# Altium schematic sheet Sheet6.SchDoc
size B; SheetNumber: 2
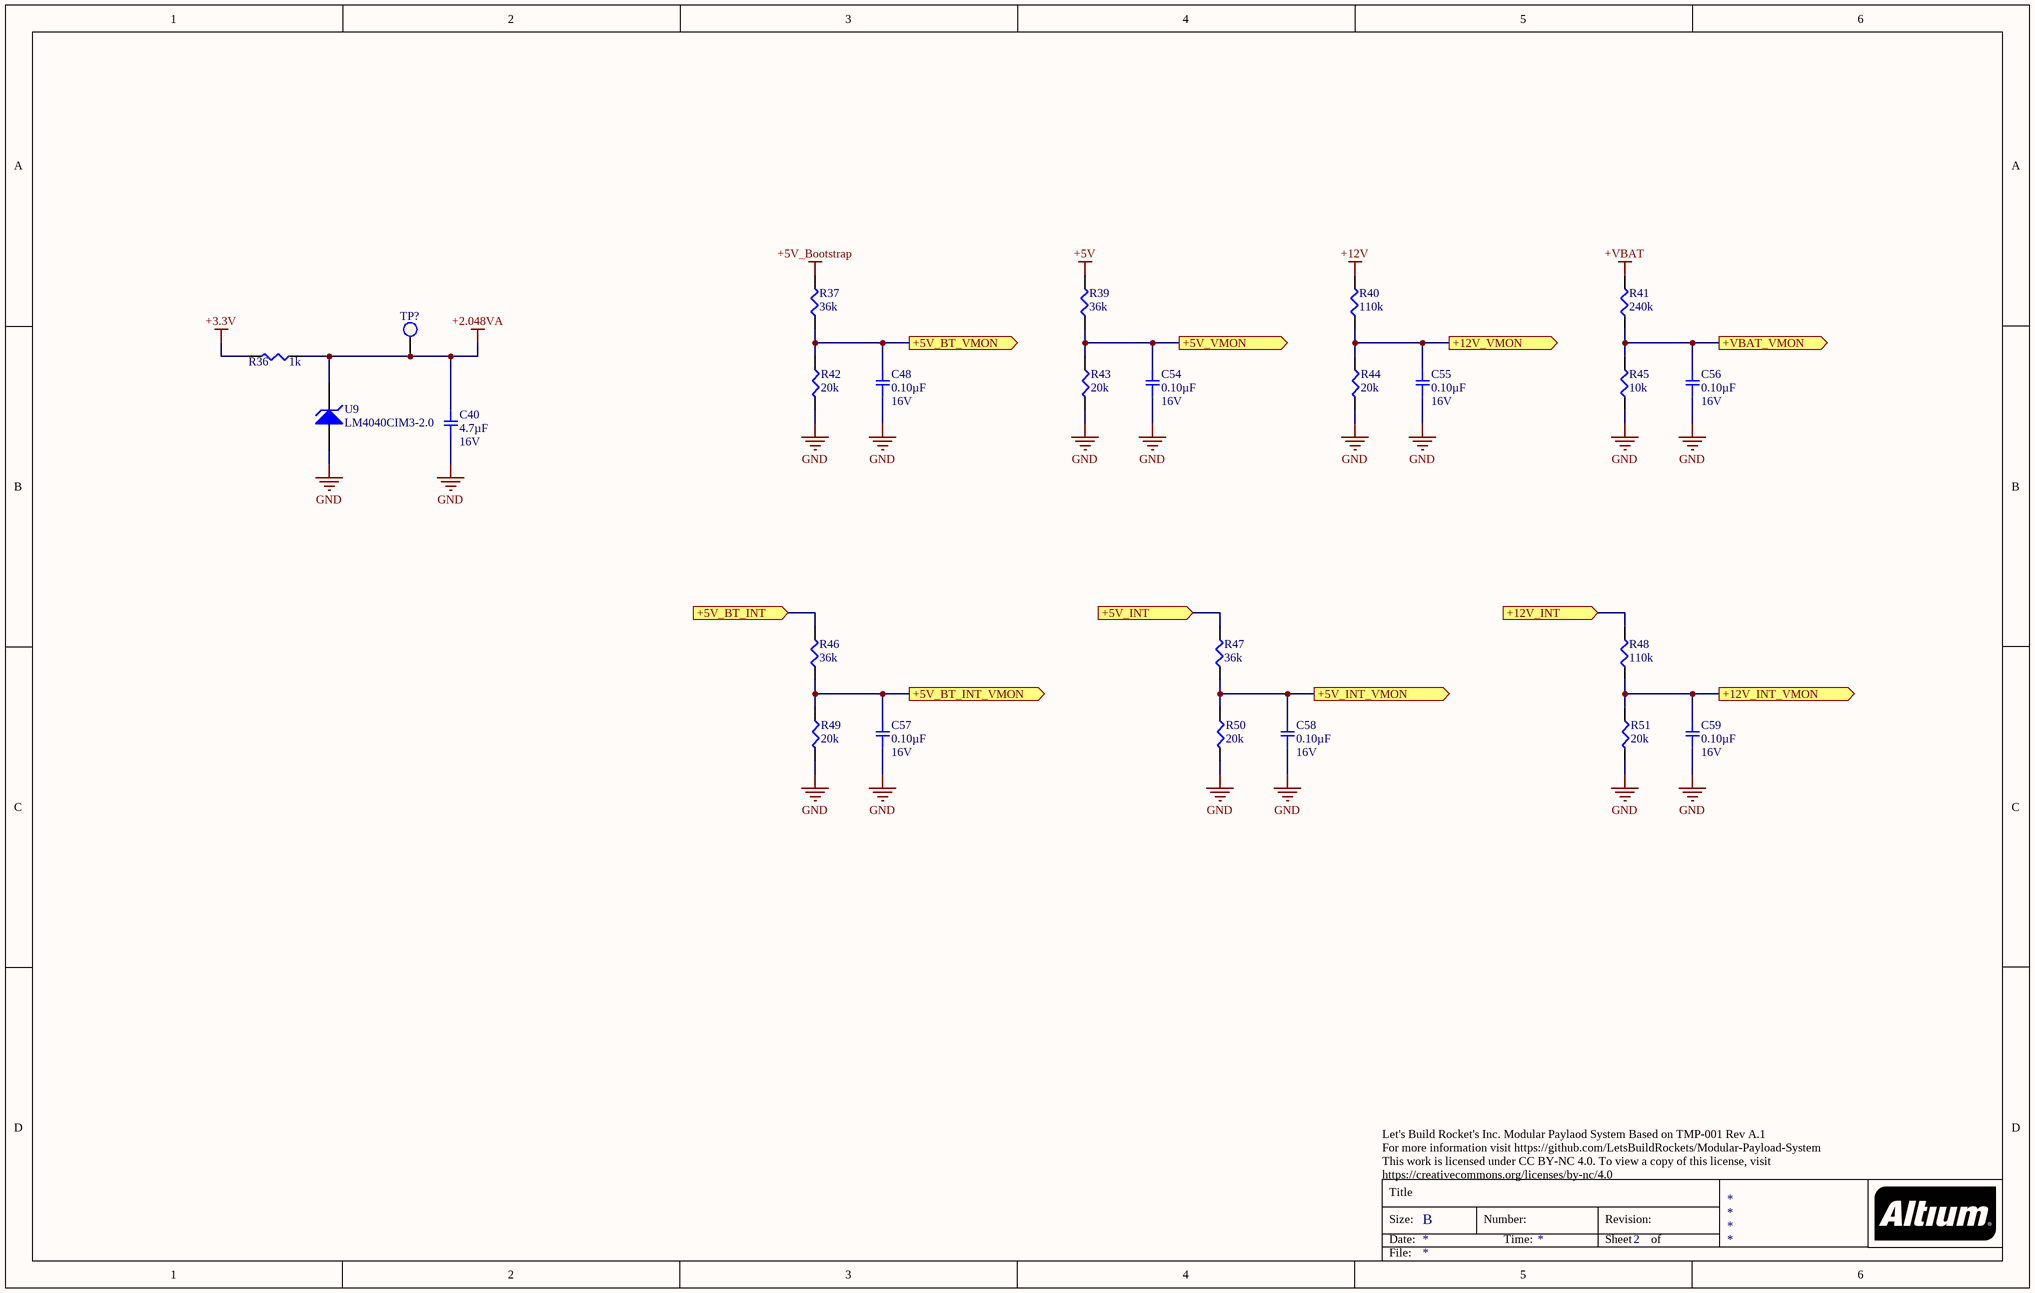
[diagram p0: Sheet6.SchDoc]

## Parts
C40  4.7µF  Voltage: 16V  [SMD-0805C]
C48  0.10µF  Voltage: 16V  [SMD-0402C]
C54  0.10µF  Voltage: 16V  [SMD-0402C]
C55  0.10µF  Voltage: 16V  [SMD-0402C]
C56  0.10µF  Voltage: 16V  [SMD-0402C]
C57  0.10µF  Voltage: 16V  [SMD-0402C]
C58  0.10µF  Voltage: 16V  [SMD-0402C]
C59  0.10µF  Voltage: 16V  [SMD-0402C]
R36  1k  [SMD-0402-RES]
R37  36k  [SMD-0805-RES]
R39  36k  [SMD-0805-RES]
R40  110k  [SMD-0805-RES]
R41  240k  [SMD-0805-RES]
R42  20k  [SMD-0805-RES]
R43  20k  [SMD-0805-RES]
R44  20k  [SMD-0805-RES]
R45  10k  [SMD-0805-RES]
R46  36k  [SMD-0805-RES]
R47  36k  [SMD-0805-RES]
R48  110k  [SMD-0805-RES]
R49  20k  [SMD-0805-RES]
R50  20k  [SMD-0805-RES]
R51  20k  [SMD-0805-RES]
TP?  TP  [TP_SMD_40]  (value not drawn)  (no BOM)
U9  LM4040CIM3-2.0  [SOT95P237X112-3N (LM4040)]

## Ports
+5V_BT_INT (in), +5V_BT_INT_VMON (out), +5V_BT_VMON (out), +5V_INT (in), +5V_INT_VMON (out), +5V_VMON (out), +12V_INT (in), +12V_INT_VMON (out), +12V_VMON (out), +VBAT_VMON (out)

## Nets
+2.048VA: C40.2 R36.1 TP?.1 U9.K
+3.3V: R36.2
+5V: R39.2
+5V_Bootstrap: R37.2
+12V: R40.2
+VBAT: R41.2
GND: C40.1 C48.1 C54.1 C55.1 C56.1 C57.1 C58.1 C59.1 R42.2 R43.2 R44.2 R45.1 R49.2 R50.2 R51.2 U9.A
+5V_BT_INT: R46.2 ; port +5V_BT_INT
+5V_BT_INT_VMON: C57.2 R46.1 R49.1 ; port +5V_BT_INT_VMON
+5V_BT_VMON: C48.2 R37.1 R42.1 ; port +5V_BT_VMON
+5V_INT: R47.2 ; port +5V_INT
+5V_INT_VMON: C58.2 R47.1 R50.1 ; port +5V_INT_VMON
+5V_VMON: C54.2 R39.1 R43.1 ; port +5V_VMON
+12V_INT: R48.2 ; port +12V_INT
+12V_INT_VMON: C59.2 R48.1 R51.1 ; port +12V_INT_VMON
+12V_VMON: C55.2 R40.1 R44.1 ; port +12V_VMON
+VBAT_VMON: C56.2 R41.1 R45.2 ; port +VBAT_VMON

## Notes on the sheet
- Let's Build Rocket's Inc. Modular Paylaod System Based on TMP-001 Rev A.1
  For more information visit https://github.com/LetsBuildRockets/Modular-Payload-System
  This work is licensed under CC BY-NC 4.0. To view a copy of this license, visit https://creativecommons.org/licenses/by-nc/4.0
- Title
- Size:
- Date:
- B
- Number:
- Time:
- Revision:
- Sheet
- of
- File:

## Library data of the parts
C40 = GCJ21BR71C475KA01L: CAP CER 4.7UF 16V X7R 0805; Manufacturer: Murata Electronics North America; Factory Stock: 0; Unit Price (USD): 0.44; Minimum Quantity: 1; Tolerance: ±10%; Datasheets: http://www.murata.com/~/media/webrenewal/support/library/catalog/products/capacitor/mlcc/c03e.ashx; Image: //media.digikey.com/Renders/Murata%20Renders/0805%20(2012%20Metric)%20.85mm.jpg; Digi-Key Part Number: 490-10557-1-ND; Part Number: GCJ21BR71C475KA01L; Quantity Available: 53217; @ qty: 0; Packaging: Cut Tape (CT); Series: GCJ; Part Status: Active; Value: 4.7µF; Temperature Coefficient: X7R; Operating Temperature: -55°C ~ 125°C; Features: Soft Termination; Ratings: AEC-Q200; Applications: Automotive, Boardflex Sensitive; Mounting Type: Surface Mount, MLCC; Package / Case: 0805 (2012 Metric); Size / Dimension: 0.079" L x 0.049" W (2.00mm x 1.25mm); Height - Seated (Max): -; Thickness (Max): 0.057" (1.45mm); Lead Spacing: -; Lead Style: -
C48 C54-C59 = GCM155R71C104KA55D: CAP CER 0.1UF 16V X7R 0402; Manufacturer: Murata Electronics North America; Factory Stock: 0; Unit Price (USD): 0.1; Minimum Quantity: 1; Tolerance: ±10%; Datasheets: http://www.murata.com/~/media/webrenewal/support/library/catalog/products/capacitor/mlcc/c03e.ashx; Image: //media.digikey.com/Renders/Murata%20Renders/ZRB-SERIES-0402.jpg; Digi-Key Part Number: 490-4759-1-ND; Part Number: GCM155R71C104KA55D; Quantity Available: 734194; @ qty: 0; Packaging: Cut Tape (CT); Series: GCM; Part Status: Active; Value: 0.10µF; Temperature Coefficient: X7R; Operating Temperature: -55°C ~ 125°C; Features: -; Ratings: AEC-Q200; Applications: Automotive; Mounting Type: Surface Mount, MLCC; Package / Case: 0402 (1005 Metric); Size / Dimension: 0.039" L x 0.020" W (1.00mm x 0.50mm); Height - Seated (Max): -; Thickness (Max): 0.022" (0.55mm); Lead Spacing: -; Lead Style: -
R36 = ERJ-2GEJ102X: RES SMD 1K OHM 5% 1/10W 0402; Manufacturer: Panasonic Electronic Components; Factory Stock: 0; Unit Price (USD): 0.00350; @ qty: 1500; Minimum Quantity: 1; Power (Watts): 0.1W, 1/10W; Temperature Coefficient: ±200ppm/°C; Part Number: ERJ-2GEJ102X; Datasheets: http://industrial.panasonic.com/www-cgi/jvcr13pz.cgi?E+PZ+3+AOA0001+ERJ2GEJ102X+7+WW; Image: //media.digikey.com/Photos/Panasonic%20Photos/ERJ-PA2-Series.jpg; Digi-Key Part Number: P1.0KJCT-ND; Quantity Available: 1939857; Packaging: Cut Tape (CT); Series: ERJ; Part Status: Active; Value: 1k; Tolerance: ±5%; Composition: Thick Film; Features: Automotive AEC-Q200; Operating Temperature: -55°C ~ 155°C; Package / Case: 0402 (1005 Metric); Supplier Device Package: 0402; Size / Dimension: 0.039" L x 0.020" W (1.00mm x 0.50mm); Height - Seated (Max): 0.016" (0.40mm); Number of Terminations: 2; Failure Rate: -
R37 R39 R46 R47 = ERJ-PB6B3602V: RES SMD 36K OHM 0.1% 1/4W 0805; Manufacturer: Panasonic Electronic Components; Factory Stock: 0; Unit Price (USD): 0.04554; @ qty: 1000; Minimum Quantity: 1; Power (Watts): 0.25W, 1/4W; Temperature Coefficient: ±50ppm/°C; Part Number: ERJ-PB6B3602V; Datasheets: https://industrial.panasonic.com/cdbs/www-data/pdf/RDA0000/AOA0000C100.pdf; Image: //media.digikey.com/Renders/Panasonic%20Renders/ERJ-0805%20Pkg.jpg; Digi-Key Part Number: P20770CT-ND; Quantity Available: 10000; Packaging: Cut Tape (CT); Series: ERJ; Part Status: Active; Value: 36k; Tolerance: ±0.1%; Composition: Thick Film; Features: Automotive AEC-Q200, Pulse Withstanding; Operating Temperature: -55°C ~ 155°C; Package / Case: 0805 (2012 Metric); Supplier Device Package: 0805; Size / Dimension: 0.079" L x 0.049" W (2.00mm x 1.25mm); Height - Seated (Max): 0.028" (0.70mm); Number of Terminations: 2; Failure Rate: -
R40 R48 = ERJ-PB6B1103V: RES SMD 110K OHM 0.1% 1/4W 0805; Manufacturer: Panasonic Electronic Components; Factory Stock: 0; Unit Price (USD): 0.04554; @ qty: 1000; Minimum Quantity: 1; Power (Watts): 0.25W, 1/4W; Temperature Coefficient: ±50ppm/°C; Part Number: ERJ-PB6B1103V; Datasheets: https://industrial.panasonic.com/cdbs/www-data/pdf/RDA0000/AOA0000C100.pdf; Image: //media.digikey.com/Renders/Panasonic%20Renders/ERJ-0805%20Pkg.jpg; Digi-Key Part Number: P20826CT-ND; Quantity Available: 10000; Packaging: Cut Tape (CT); Series: ERJ; Part Status: Active; Value: 110k; Tolerance: ±0.1%; Composition: Thick Film; Features: Automotive AEC-Q200, Pulse Withstanding; Operating Temperature: -55°C ~ 155°C; Package / Case: 0805 (2012 Metric); Supplier Device Package: 0805; Size / Dimension: 0.079" L x 0.049" W (2.00mm x 1.25mm); Height - Seated (Max): 0.028" (0.70mm); Number of Terminations: 2; Failure Rate: -
R41 = ERJ-PB6B2403V: RES SMD 240K OHM 0.1% 1/4W 0805; Manufacturer: Panasonic Electronic Components; Factory Stock: 0; Unit Price (USD): 0.04554; @ qty: 1000; Minimum Quantity: 1; Power (Watts): 0.25W, 1/4W; Temperature Coefficient: ±50ppm/°C; Part Number: ERJ-PB6B2403V; Datasheets: https://industrial.panasonic.com/cdbs/www-data/pdf/RDA0000/AOA0000C100.pdf; Image: //media.digikey.com/Renders/Panasonic%20Renders/ERJ-0805%20Pkg.jpg; Digi-Key Part Number: P20863CT-ND; Quantity Available: 10000; Packaging: Cut Tape (CT); Series: ERJ; Part Status: Active; Value: 240k; Tolerance: ±0.1%; Composition: Thick Film; Features: Automotive AEC-Q200, Pulse Withstanding; Operating Temperature: -55°C ~ 155°C; Package / Case: 0805 (2012 Metric); Supplier Device Package: 0805; Size / Dimension: 0.079" L x 0.049" W (2.00mm x 1.25mm); Height - Seated (Max): 0.028" (0.70mm); Number of Terminations: 2; Failure Rate: -
R42-R44 R49-R51 = ERJ-PB6B2002V: RES SMD 20K OHM 0.1% 1/4W 0805; Manufacturer: Panasonic Electronic Components; Factory Stock: 0; Unit Price (USD): 0.04554; @ qty: 1000; Minimum Quantity: 1; Power (Watts): 0.25W, 1/4W; Temperature Coefficient: ±50ppm/°C; Part Number: ERJ-PB6B2002V; Datasheets: https://industrial.panasonic.com/cdbs/www-data/pdf/RDA0000/AOA0000C100.pdf; Image: //media.digikey.com/Renders/Panasonic%20Renders/ERJ-0805%20Pkg.jpg; Digi-Key Part Number: P20740CT-ND; Quantity Available: 10000; Packaging: Cut Tape (CT); Series: ERJ; Part Status: Active; Value: 20k; Tolerance: ±0.1%; Composition: Thick Film; Features: Automotive AEC-Q200, Pulse Withstanding; Operating Temperature: -55°C ~ 155°C; Package / Case: 0805 (2012 Metric); Supplier Device Package: 0805; Size / Dimension: 0.079" L x 0.049" W (2.00mm x 1.25mm); Height - Seated (Max): 0.028" (0.70mm); Number of Terminations: 2; Failure Rate: -
R45 = ERJ-PB6B1002V: RES SMD 10K OHM 0.1% 1/4W 0805; Manufacturer: Panasonic Electronic Components; Factory Stock: 0; Unit Price (USD): 0.04554; @ qty: 1000; Minimum Quantity: 1; Power (Watts): 0.25W, 1/4W; Temperature Coefficient: ±50ppm/°C; Part Number: ERJ-PB6B1002V; Datasheets: https://industrial.panasonic.com/cdbs/www-data/pdf/RDA0000/AOA0000C100.pdf; Image: //media.digikey.com/Renders/Panasonic%20Renders/ERJ-0805%20Pkg.jpg; Digi-Key Part Number: P20708CT-ND; Quantity Available: 10000; Packaging: Cut Tape (CT); Series: ERJ; Part Status: Active; Value: 10k; Tolerance: ±0.1%; Composition: Thick Film; Features: Automotive AEC-Q200, Pulse Withstanding; Operating Temperature: -55°C ~ 155°C; Package / Case: 0805 (2012 Metric); Supplier Device Package: 0805; Size / Dimension: 0.079" L x 0.049" W (2.00mm x 1.25mm); Height - Seated (Max): 0.028" (0.70mm); Number of Terminations: 2; Failure Rate: -